# Altium schematic sheet Khoi-nguon.SchDoc
size A; SheetNumber: 2; SheetTotal: 2
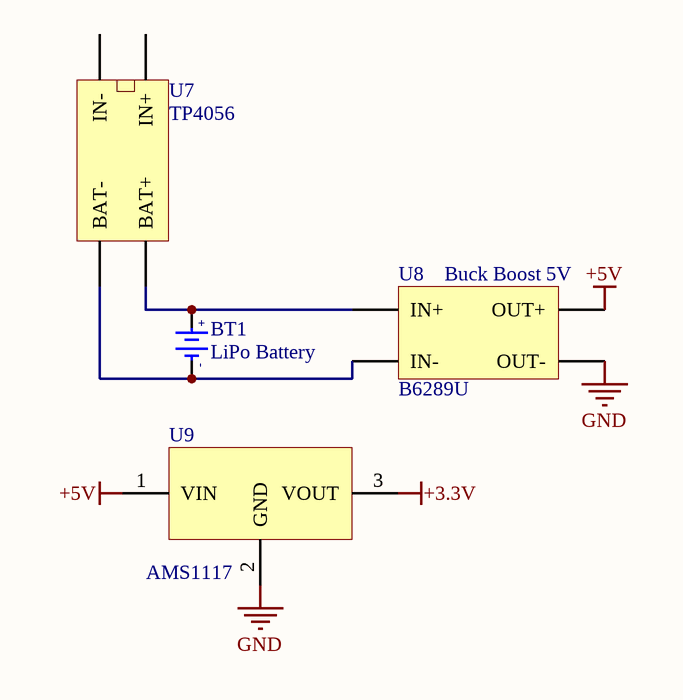
[diagram p0: Khoi-nguon.SchDoc]

## Parts
BT1  LiPo Battery  [PIN3V]
U7  TP4056
U8  B6289U
U9  AMS1117

## Nets
+3.3V: U9.3(VOUT)
+5V: U8.3(OUT+) U9.1(VIN)
GND: U8.4(OUT-) U9.2(GND)
NetBT1_1: BT1.1(+3V) U7.2(IN-) U8.1(IN+)
NetBT1_2: BT1.2(GND) U7.3(IN+) U8.2(IN-)

## Notes on the sheet
- (near U8) Buck Boost 5V
- (in symbol PIN 3V) +; -

## Library data of the parts
BT1 = PIN 3V: Battery 3VDC; Value: PIN 3V
U7 = TP4056: Module sac pin
U8 = B6289U: Module Buck Boost 5V